# EAGLE design USB_RF_Gateway_v.0.1 (EAGLE 9.3.0)
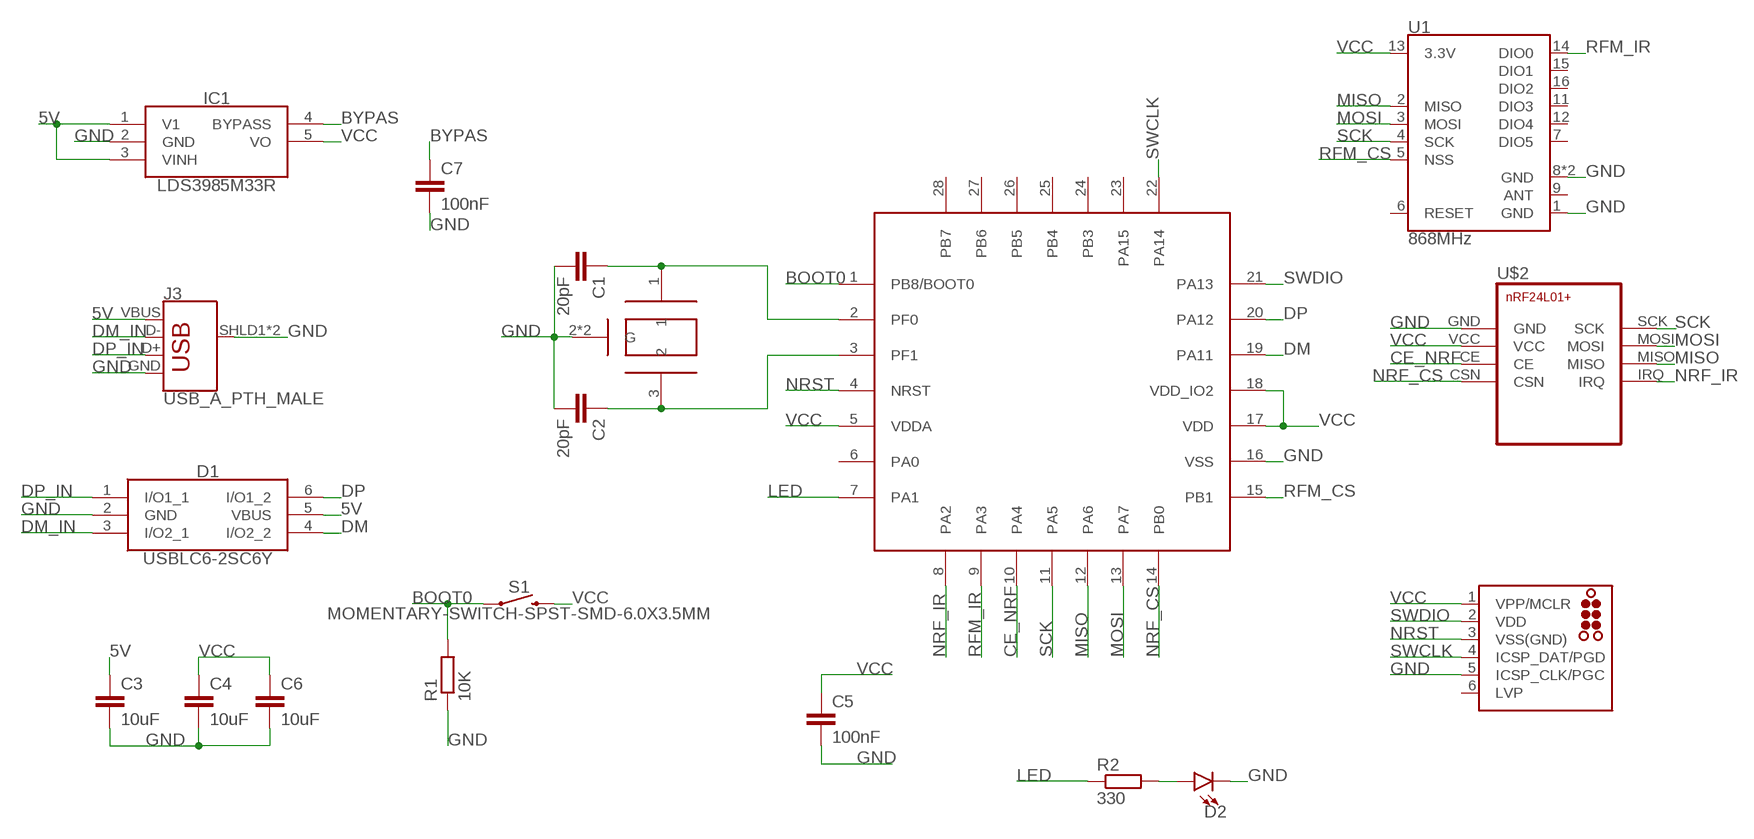
[diagram p0: schematic, sheet 1]

## Parts
C1  20pF  C-EUC0603  [C0603]
C2  20pF  C-EUC0603  [C0603]
C3  10uF  C-EUC0805  [C0805]
C4  10uF  C-EUC0805  [C0805]
C5  100nF  C-EUC0603  [C0603]
C6  10uF  C-EUC0805  [C0805]
C7  100nF  C-EUC0603  [C0603]
D1  USBLC6-2SC6Y  [SOT95P280X145-6N]
D2  LED0603  [LED-0603]
IC1  LDS3985M33R  [SOT95P280X145-5N]
J2  TC2030-MCP-NL  [TC2030-MCP-NL]
J3  USB_A_PTH_MALE  [USB-A-H]
R1  10K  R-EU_R0603  [R0603]
R2  330  R-EU_R0603  [R0603]
S1  MOMENTARY-SWITCH-SPST-SMD-6.0X3.5MM  [TACTILE_SWITCH_SMD_6.0X3.5MM]
U1  868MHz  RFM69HCW-915  [RFM69HCW-XXXS2]
U$1  ECS-160-12-37B-CTN-TR  [ECS-160-12-37B-CTN]
U$2  NRF24L01+NRF24L01+MINI  [NRF24L01+MINI]
U$3  STMF042G6U6  [STM32F042_UFQPN28_4X4MM]

## Nets
5V: C3.1 D1.5(VBUS) IC1.1(V1) IC1.3(VINH) J3.VBUS
BOOT0: R1.2 S1.1 U$3.1(PB8/BOOT0)
BYPAS: C7.1 IC1.4(BYPASS)
CE_NRF: U$2.CE U$3.10(PA4)
DM: D1.4(I/O2_2) U$3.19(PA11)
DM_IN: D1.3(I/O2_1) J3.D-
DP: D1.6(I/O1_2) U$3.20(PA12)
DP_IN: D1.1(I/O1_1) J3.D+
GND: C1.2 C2.2 C3.2 C4.2 C5.2 C6.2 C7.2 D1.2(GND) D2.C IC1.2(GND) J2.5(ICSP_CLK/PGC) J3.GND J3.SHLD1(SHIELD) J3.SHLD2(SHIELD) R1.1 U1.1(GND) U1.8(GND) U1.10(GND) U$1.2(G) U$1.4(G) U$2.GND U$3.16(VSS)
LED: R2.1 U$3.7(PA1)
MISO: U1.2(MISO) U$2.MISO U$3.12(PA6)
MOSI: U1.3(MOSI) U$2.MOSI U$3.13(PA7)
N$1: C1.1 U$1.1 U$3.2(PF0)
N$2: C2.1 U$1.3 U$3.3(PF1)
N$4: D2.A R2.2
NRF_CS: U$2.CSN U$3.14(PB0)
NRF_IR: U$2.IRQ U$3.8(PA2)
NRST: J2.3(VSS(GND)) U$3.4(NRST)
RFM_CS: U1.5(NSS) U$3.15(PB1)
RFM_IR: U1.14(DIO0) U$3.9(PA3)
SCK: U1.4(SCK) U$2.SCK U$3.11(PA5)
SWCLK: J2.4(ICSP_DAT/PGD) U$3.22(PA14)
SWDIO: J2.2(VDD) U$3.21(PA13)
VCC: C4.1 C5.1 C6.1 IC1.5(VO) J2.1(VPP/MCLR) S1.2 U1.13(3.3V) U$2.VCC U$3.5(VDDA) U$3.17(VDD) U$3.18(VDD_IO2)
Unconnected: J2.6(LVP) U1.6(RESET) U1.7(DIO5) U1.9(ANT) U1.11(DIO3) U1.12(DIO4) U1.15(DIO1) U1.16(DIO2) U$3.6(PA0) U$3.23(PA15) U$3.24(PB3) U$3.25(PB4) U$3.26(PB5) U$3.27(PB6) U$3.28(PB7)

## Library data of the parts
C1-C7 = rcl:C-EU: CAPACITOR, European symbol; SPICEPREFIX: C
D1 = USBLC6-2SC6Y:USBLC6-2SC6Y: Low Cap. ESD Protection Auto SOT-23-6 STMicroelectronics USBLC6-2SC6Y, Dual Uni-Directional TVS Diode Array, 6-Pin SOT-23 Source: Datasheet <https://componentsearchengine.com/Datasheets/1/USBLC6-2SC6Y.pdf>; DESCRIPTION: Low Cap. ESD Protection Auto SOT-23-6 STMicroelectronics USBLC6-2SC6Y, Dual Uni-Directional TVS Diode Array, 6-Pin SOT-23; HEIGHT: 1.45mm; MANUFACTURER_NAME: STMicroelectronics; MANUFACTURER_PART_NUMBER: USBLC6-2SC6Y; MOUSER_PART_NUMBER: 511-USBLC6-2SC6Y; MOUSER_PRICE-STOCK: https://www.mouser.com/Search/Refine.aspx?Keyword=511-USBLC6-2SC6Y; RS_PART_NUMBER: 8805525P; RS_PRICE-STOCK: http://uk.rs-online.com/web/p/products/8805525P
D2 = SparkFun-LED:LED: LED (Generic) Standard schematic elements and footprints for 5mm, 3mm, 1206, and 0603 sized LEDs. Generic LEDs with no color specified.
IC1 = LDS3985M33R:LDS3985M33R: STMicroelectronics LDS3985M33R, Single Low Dropout Voltage Regulator, 300mA 3.3 V, 5-Pin SOT-23 Source: Datasheet <https://componentsearchengine.com/Datasheets/1/LDS3985M33R.pdf>; DESCRIPTION: STMicroelectronics LDS3985M33R, Single Low Dropout Voltage Regulator, 300mA 3.3 V, 5-Pin SOT-23; HEIGHT: 1.45mm; MANUFACTURER_NAME: STMicroelectronics; MANUFACTURER_PART_NUMBER: LDS3985M33R; MOUSER_PART_NUMBER: 511-LDS3985M33R; MOUSER_PRICE-STOCK: https://www.mouser.com/Search/Refine.aspx?Keyword=511-LDS3985M33R; RS_PART_NUMBER: 8805323P; RS_PRICE-STOCK: http://uk.rs-online.com/web/p/products/8805323P
J2 = tag-connect:TC2030: TAG-CONNECT ICSP Connector Manufacturer: Tag-Connect <http://www.tag-connect.com> Cable for easy In-Circuit Serial Programming. Designed for Microchip ICD2, suitable for many others. Two variants - one "with legs" (for hands-free fit on PCB) and another "without legs" for quick programming. PAD Description 1 MCLR/Vpp 2 Vdd 3 GND 4 PGD (ISPDAT) 5 PGC (ISPCLK) 6 nc (used for LVP) ©2009 ROFA.cz - modified and updated by Robert Darlington ‹rdarlington@gmail.com›
J3 = SparkFun-Connectors:USB_A: USB-A Connector Male and female variants, as well as PTH and SMT variants SparkFun Products: SparkFun XBee Explorer Dongle <https://www.sparkfun.com/products/11697> PTH Male SparkFun MicroView-USB Programmer <https://www.sparkfun.com/products/12924> SMT Male SparkFun USB Type A Female Breakout <https://www.sparkfun.com/products/12700> SMT Female; PROD_ID: CONN-08367; SF_ID: PRT-00437
R1 R2 = rcl:R-EU_: RESISTOR, European symbol; SPICEPREFIX: R
S1 = SparkFun-Switches:MOMENTARY-SWITCH-SPST: Momentary Switch (Pushbutton) - SPST Normally-open (NO) SPST momentary switches (buttons, pushbuttons). Variants PTH-12MM - 12mm square, through-hole Momentary Pushbutton Switch - 12mm Square <https://www.sparkfun.com/products/9190> (COM-09190) PTH-6.0MM, PTH-6.0MM-KIT - 6.0mm square, through-hole Mini Pushbutton Switch <https://www.sparkfun.com/products/97> (COM-00097) KIT package intended for soldering kit's - only one side of pads' copper is exposed. PTH-RIGHT-ANGLE-KIT - Right-angle, through-hole Right Angle Tactile Button <https://www.sparkfun.com/products/10791> - Used on SparkFun BigTime Watch Kit <https://www.sparkfun.com/products/11734> SMD-12MM - 12mm square, surface-mount Tactile Button - SMD (12mm) <https://www.sparkfun.com/products/12993> (COM-12993) Used on SparkFun PicoBoard <https://www.sparkfun.com/products/11888> SMD-4.5MM - 4.5mm Square Trackball Switch Used on SparkFun Blackberry Trackballer Breakout <https://www.sparkfun.com/products/13169> SMD-4.6MMX2.8MM - 4.60mm x 2.80mm, surface mount Used on SparkFun SAMD21 Mini Breakout <https://www.sparkfun.com/products/13664> SMD-5.2MM, SMD-5.2-REDUNDANT - 5.2mm square, surface-mount Mini Pushbutton Switch - SMD <https://www.sparkfun.com/products/8720> (COM-08720) Used on Arduino Pro Mini <https://www.sparkfun.com/products/11114> REDUNDANT package connects both switch circuits together SMD-6.0X3.5MM - 6.0 x 3.5mm, surface mount Momentary Reset Switch SMD <https://www.sparkfun.com/products/8229> (COM-08229) SMD-6.2MM-TALL - 6.2mm square, surface mount Tactile Button - SMD (6mm) <https://www.sparkfun.com/products/12992> Used on SparkFun Digital Sandbox <https://www.sparkfun.com/products/12651> SMD-RIGHT-ANGLE - Right-angle, surface mount Used on SparkFun Block for Intel® Edison - Arduino <https://www.sparkfun.com/products/13036>; PROD_ID: SWCH-00815; SF_SKU: COM-08229
U1 = SparkFun-RF:RFM69H: Hope RF RFM69H ISM Transceiver Module The RFM69H is a transceiver module capable of operation over a wide frequency range, including the 315,433,868 and 915MHz license-free ISM (Industry Scientific and Medical) frequency bands. All major RF communication parameters are programmable and most of them can be dynamically set. The RFM69H offers the unique advantage of programmable narrow-band and wide- band communication modes. The RFM69H is optimized for low power consumption while offering high RF output power and channelized operation.Compliance ETSI and FCC regulations. Datasheet <http://www.hoperf.cn/upload/docs/RF/SX/RFM69H_DataSheet_v1.3.pdf> SparkFun Products RFM69HCW Wireless Transceiver - 915MHz <https://www.sparkfun.com/products/13909> (COM-13909) RFM69HCW Wireless Transceiver - 434MHz <https://www.sparkfun.com/products/13910> (COM-13910) SparkFun RFM69 Breakout (915MHz) <https://www.sparkfun.com/products/12775> (WRL-12775) SparkFun RFM69 Breakout (434MHz) <https://www.sparkfun.com/products/12823> (WRL-12823); PROD_ID: IC-11997; VALUE: 915MHz
U$1 = ESC-160-12:ECS-160-12-37B-CTN-TR
U$2 = nrf24L01+ 2:NRF24L01+: nRF24L01+ Transceiver Module
U$3 = STM32L031G6:STMF042G6U6

## Board
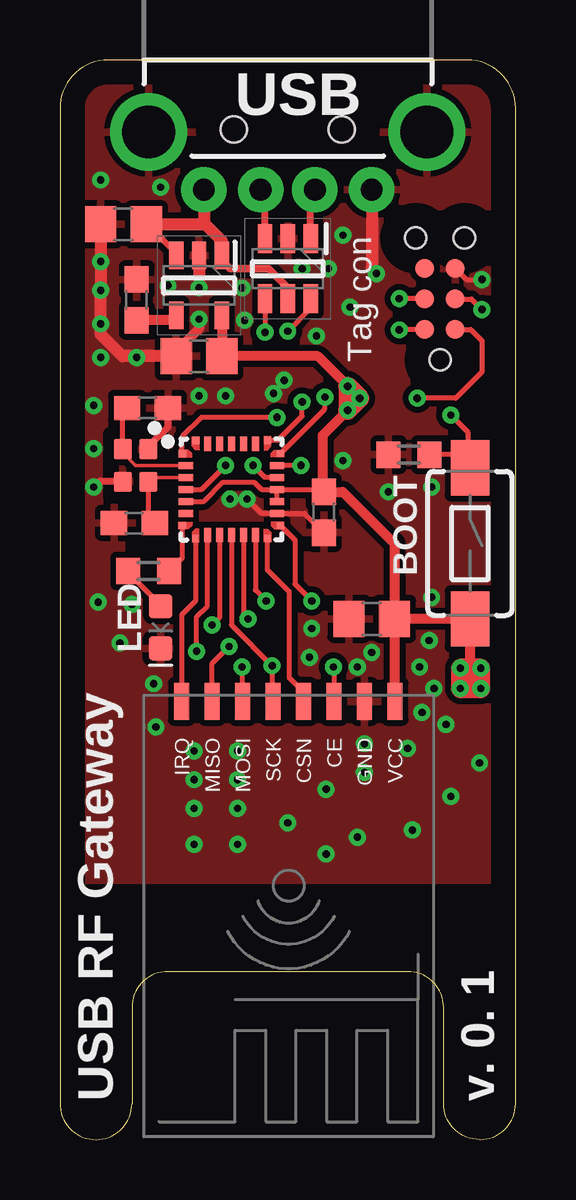
[diagram p1: board, top side]
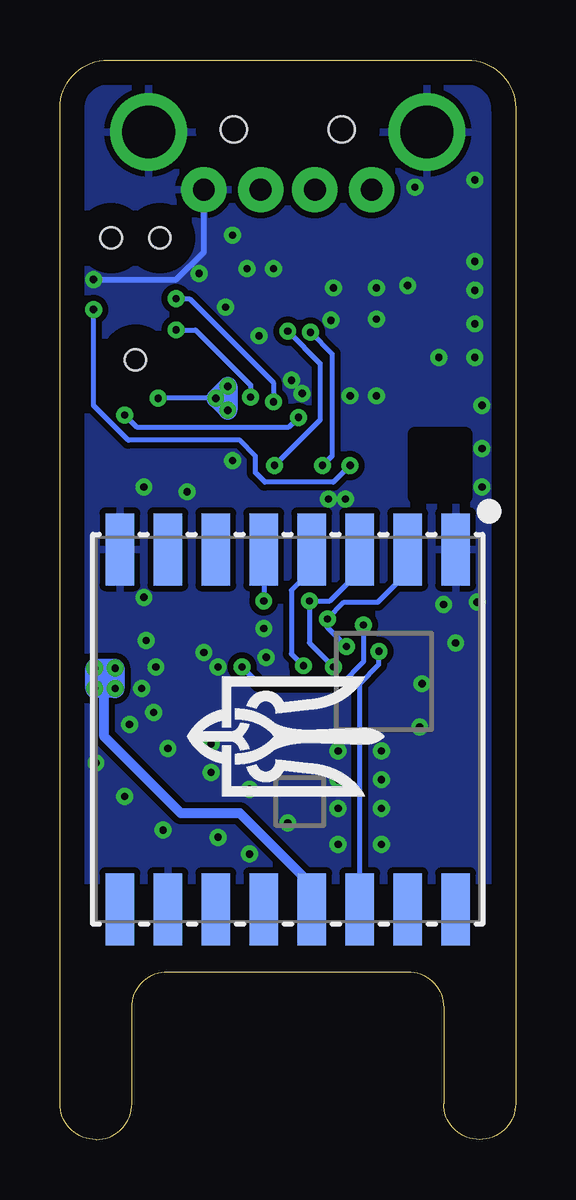
[diagram p2: board, bottom side, seen from below]

Size 19 x 45 mm. Coordinates in mm from the lower left corner, seen from the top.
Outline: 0,43 0,1.5 arc90 1.5,0 arc90 3,1.5 3,5.5 arc-90 4.5,7 14.5,7 arc-90 16,5.5 16,1.5 arc90 17.5,0 arc90 19,1.5 19,43 arc90 17,45 2,45 arc90 0,43
Copper layers (1*16): Top 0.035mm / dielectric 1.5mm / Bottom 0.035mm
Design rules "default *": minimum track width 6mil, minimum drill 0.3mm, track to track 6mil, track to pad 6mil, pad to pad 6mil, via to via 6mil, smd to smd 6mil, copper to edge 40mil, drill to drill 6mil, minimum pad ring 10mil, minimum via ring 8mil, stop-mask expansion 4mil, vias tented up to drill 14mil, thermal gap 10mil
tRestrict: 7 lines
bRestrict: 5 lines

### Footprints (pad centres in the part's own frame; a part is rotated, then mirrored left to right if it is on the bottom)
C0603 = smd 1.1 x 1: 1 -0.85,0; 2 0.85,0
C0805 = smd 1.3 x 1.5: 1 -0.95,0; 2 0.95,0
SOT95P280X145-6N = smd 1.2 x 0.6: 1 -1.25,0.95; 2 -1.25,0; 3 -1.25,-0.95; 4 1.25,-0.95; 5 1.25,0; 6 1.25,0.95
LED-0603 = smd 1 x 1: A -0.877,0; C 0.877,0
SOT95P280X145-5N = smd 1.15 x 0.6: 1 -1.25,0.95; 2 -1.25,0; 3 -1.25,-0.95; 4 1.25,-0.95; 5 1.25,0.95
TC2030-MCP-NL = smd 0.787 x 0.787: 1 1.27,-0.635; 2 1.27,0.635; 3 2.54,-0.635; 4 2.54,0.635; 5 3.81,-0.635; 6 3.81,0.635 | hole 0.889: 0,0; 5.08,-1.016; 5.08,1.016
USB-A-H = drill 0.914 pad 1.88: D+ 2.4,1.127; D- 2.4,-1.127; GND 2.4,3.5; VBUS 2.4,-3.5 | drill 2.2: SHLD1 0,-5.8; SHLD2 0,5.8 | hole 1.1: -0.1,2.25; -0.1,-2.25
R0603 = smd 1 x 1.1: 1 -0.85,0; 2 0.85,0
TACTILE_SWITCH_SMD_6.0X3.5MM = smd 2.3 x 1.6: 1 -3.15,0; 2 3.15,0
RFM69HCW-XXXS2 = smd 3 x 1.2: 1 -7.5,7; 2 -7.5,5; 3 -7.5,3; 4 -7.5,1; 5 -7.5,-1; 6 -7.5,-3; 7 -7.5,-5; 8 -7.5,-7; 9 7.5,-7; 10 7.5,-5; 11 7.5,-3; 12 7.5,-1; 13 7.5,1; 14 7.5,3; 15 7.5,5; 16 7.5,7
ECS-160-12-37B-CTN = smd 0.85 x 0.75: 1 -0.68,-0.53; 2 0.68,-0.53; 3 0.68,0.53; 4 -0.68,0.53
NRF24L01+MINI = smd 0.635 x 1.524: CE -1.575,-7.861; CSN -0.305,-7.861; GND -2.845,-7.861; IRQ 4.775,-7.861; MISO 3.505,-7.861; MOSI 2.235,-7.861; SCK 0.965,-7.861; VCC -4.115,-7.861
STM32F042_UFQPN28_4X4MM = smd 0.3 x 0.3: 1 -2.05,1.5; 7 -2.05,-1.5; 8 -1.5,-2.05; 14 1.5,-2.05; 15 2.05,-1.5; 21 2.05,1.5; 22 1.5,2.05; 28 -1.5,2.05 | smd 0.6 x 0.3: 2 -1.9,1; 3 -1.9,0.5; 4 -1.9,0; 5 -1.9,-0.5; 6 -1.9,-1; 16 1.9,-1; 17 1.9,-0.5; 18 1.9,0; 19 1.9,0.5; 20 1.9,1 | smd 0.3 x 0.6: 9 -1,-1.9; 10 -0.5,-1.9; 11 0,-1.9; 12 0.5,-1.9; 13 1,-1.9; 23 1,1.9; 24 0.5,1.9; 25 0,1.9; 26 -0.5,1.9; 27 -1,1.9

### Placement (x,y rotation side)
C1  3.65,30.5 0 top
C2  3.1,25.7 180 top
C3  2.65,38.15 180 top
C4  5.8,32.65 180 top
C5  11,26.15 270 top
C6  13,21.7 180 top
C7  3.2,35 90 top
D1  9.5,36.3 270 top
D2  4.2,21.35 270 top
IC1  5.8,35.6 270 top
J2  15.85,32.5 90 top
J3  9.5,42 270 top
R1  14.55,28.55 0 top
R2  3.7,23.7 180 top
S1  17.1,24.85 270 top
U1  9.5,17.1 270 bottom
U$1  3.15,28.1 270 top
U$2  9.85,10.4 180 top
U$3  7.15,27.1 0 top
U$4  [GERB_5MM]  13.7,19.3 270 bottom

### Tracks (layer width: path | path; a pad name or v marks a point on that pad's centre or on a via)
5V
  Top 0.254: C3.1 3.6,38.05 3.75,38.05 4.85,36.95 IC1.3
  Top 0.305: D1.5 9.5,35.5 8.7,36.3 7.1,36.3 6.75,36.65 IC1.1
  Top 0.508: J3.VBUS 6,38.2 | 6,38.2 6,38.15 C3.1 | IC1.1 6.75,37.45 6,38.2
BOOT0  (via drill 0.3)
  Top 0.2: U$3.1 5.1,29.3 5.9,30.1 v9.05,30.1 | v16.3,30.2 17,29.5 17,28.1 S1.1 16.55,28.55 R1.2
  Bottom 0.2: v16.3,30.2 15.8,29.7 9.45,29.7 v9.05,30.1
BYPAS
  Top 0.406: IC1.4 4.65,34.15 C7.1
CE_NRF  (via drill 0.3)
  Top 0.2: v11.4,19.7 11.43,19.68 U$2.CE | U$3.10 6.65,21.75 v6.35,21.45
  Bottom 0.2: v11.4,19.7 10.7,19 7.25,19 6.35,19.9 v6.35,21.45
DM  (via drill 0.3)
  Top 0.2: U$3.19 8.55,27.6 v8.05,28.1 | D1.4 v8.55,33.65
  Bottom 0.2: v8.55,33.65 7.65,32.75 7.65,28.5 v8.05,28.1
DM_IN
  Top 0.3: D1.3 8.55,39.42 J3.D-
DP  (via drill 0.3)
  Top 0.2: v10.05,28.1 U$3.20 | v9.5,33.7 10.45,34.65 D1.6
  Bottom 0.2: v9.5,33.7 8.15,32.35 8.15,30 v10.05,28.1
DP_IN
  Top 0.3: D1.1 10.45,39.42 J3.D+
GND  (via drill 0.3)
  Top 0.2: J2.5 16.95,35.85 v17.6,35.85
  Top 0.203: C5.2 10.2,26.1 U$3.16 8.4,26.1 v7.8,26.7
  Top 0.3: U$1.2 1.62,27.42 v1.4,27.2 | U$1.4 3.68,28.88 4.5,29.7 C1.2
  Top 0.305: 1.75,35.35 v1.7,35.4
  Top 0.406: C4.2 4.85,32.85 5.8,33.8 v5.8,34.2
  Top 0.508: C4.2 2.6,32.65 1.7,33.55 v1.7,35.4 C3.2 | J3.GND 13,36.3 v13.2,36.1 | IC1.2 v5.8,35.5
  Bottom 0.254: v17.6,35.85 14.15,35.85 13,37 J3.GND
  other vias: 1.7,40 1.7,36.6 1.7,34 1.7,32.6 1.4,30.6 1.4,28.8 4.2,39.7 10.1,36.3 11.2,36.3 11.8,37.7 10.7,33.5 12.1,34.7 6.9,31 5.8,31 13.7,27 15.5,27.2 15.5,22.6 15.4,20.8 15,19.7 15.6,18.8 15.1,17.8 16.1,17.3 13,20.3 12.4,19.7 10.4,20.1 10.5,21.3 17.5,15.7 12.7,16.5 12.7,15.3 14.5,16.3 16.3,14.3 14.7,12.9 12.4,12.6 11.1,14.6 11.1,11.9 7.4,12.3 9.5,13.2 3,22.3 1.6,22.4 2.5,20.7 3.9,19 4,17.2 5.6,16.2 5.6,15 5.6,13.8 5.6,12.3 8.9,31.1 11.8,28.3 7.4,16.2 7.4,15 7.4,13.8 7.1,26.7 9.35,31.65 4.5,35.6 7.6,35.5 7.7,34.15 3.2,32.6
  pour Top (isolate 0.25): 0,45 0,10.8 19,10.8 19,45
  pour Bottom (isolate 0.25, rank 2): -0.5,45.5 -0.5,10.8 19.5,10.8 19.5,45.5
LED
  Top 0.2: U$3.7 5.1,24.25 R2.1
MISO  (via drill 0.3)
  Top 0.2: U$3.12 7.65,21.9 v7.85,21.7 | v7.05,20.55 6.34,19.84 U$2.MISO
  Bottom 0.2: U1.2 4.5,23.65 5.75,22.4 7.15,22.4 v7.85,21.7 7.85,21.35 v7.05,20.55
MOSI  (via drill 0.3)
  Top 0.2: U$3.13 8.15,22.9 v8.6,22.45 | v7.6,19.7 U$2.MOSI
  Bottom 0.2: U1.3 6.5,23.7 7.74,22.46 v8.59,22.46 v8.6,22.45 8.6,20.7 v7.6,19.7
N$1
  Top 0.152: U$3.2 3.15,28.1 2.62,28.63 U$1.1
  Top 0.2: C1.1 2.6,30.3 2.6,28.8 U$1.1
N$2
  Top 0.152: U$1.3 3.86,27.6 U$3.3
  Top 0.2: U$1.3 3.68,25.97 C2.1
N$4
  Top 0.2: D2.A 4.2,22.28 2.85,23.63 R2.2
NRF_CS
  Top 0.2: U$2.CSN 10.15,18.66 9.55,19.26 9.55,22.84 8.65,23.75 U$3.14
NRF_IR
  Top 0.2: U$2.IRQ 5.08,21.88 5.65,22.45 U$3.8
NRST  (via drill 0.3)
  Top 0.2: U$3.4 5.9,27.1 v6.9,28.1 | J2.3 17.16,35.04 v17.6,34.6
  Bottom 0.2: v6.9,28.1 7.6,27.4 10.45,27.4 10.85,27.8 10.85,28.5 11.5,29.15 16.15,29.15 17.6,30.6 v17.6,34.6
RFM_CS  (via drill 0.3)
  Top 0.2: U$3.15 9.8,25 9.8,23.15 v10.5,22.45
  Bottom 0.2: U1.5 v10.5,22.45
RFM_IR  (via drill 0.3)
  Top 0.2: v5.7,20.35 5.7,21.8 6.15,22.25 U$3.9
  Bottom 0.2: U1.14 6.5,19 5.7,19.8 v5.7,20.35
SCK  (via drill 0.3)
  Top 0.2: U$3.11 7.15,21.45 v8.85,19.75 8.85,18.28 U$2.SCK
  Bottom 0.2: v8.85,19.75 9.35,20.25 9.35,22.9 8.5,23.75 U1.4
SWCLK  (via drill 0.3)
  Top 0.2: U$3.22 9.1,29.15 10.1,30.15 v10.1,30.75 | J2.4 v14.15,35.05
  Bottom 0.2: v14.15,35.05 13.6,35.05 10.1,31.55 v10.1,30.75
SWDIO  (via drill 0.3)
  Top 0.2: U$3.21 11.05,30.45 v11.05,30.95 | J2.2 14.17,33.77 v14.15,33.75
  Bottom 0.2: v14.15,33.75 13.35,33.75 11.05,31.45 v11.05,30.95
VCC  (via drill 0.3)
  Top 0.2: J2.1 17.13,33.77 17.6,33.3 17.6,31.99 16.51,30.9 v14.9,30.9 | U$3.18 8.4,27.1 8.1,27.4 6.8,27.4 6,26.6 U$3.5
  Top 0.203: C5.1 10.9,27 10.88,27.02 10.8,27.1 U$3.18 U$3.17
  Top 0.406: U$2.VCC 13.96,21.68 | 17.1,19.2 S1.2 C6.1 13.95,24.85 11.8,27 C5.1 | v12,31.4 10.75,32.65 C4.1 IC1.5 | v12,30.4 10.95,29.35 10.95,27.1
  Top 0.508: 10.95,27.1 10.88,27.02 | 13.96,21.68 C6.1 | 17.1,19.2 v16.7,18.8
  Top 0.8: v16.7,19.65 v16.7,18.8 v17.55,18.8 v17.55,19.65 v16.7,19.65 | v12,31.4 v12,30.4 v12.5,30.9 v12,31.4
  Bottom 0.2: v12.5,30.9 v14.9,30.9
  Bottom 0.406: 8.5,10.6 11.5,13.6 13.95,13.6 17.15,16.8 17.15,19.25
  Bottom 0.508: U1.13 8.5,10.6 | 17.15,19.25 v17.55,19.65
  Bottom 0.8: v16.7,19.65 v16.7,18.8 v17.55,18.8 v17.55,19.65 v16.7,19.65 | v12.5,30.9 v12,31.4 v12,30.4 v12.5,30.9

### Text on the board
tPlace: USB | Tag con | BOOT | LED | USB RF Gateway | v. 0. 1